# Altium schematic sheet toplayerUCM.SchDoc
size A4; SheetNumber: 1; SheetTotal: 4
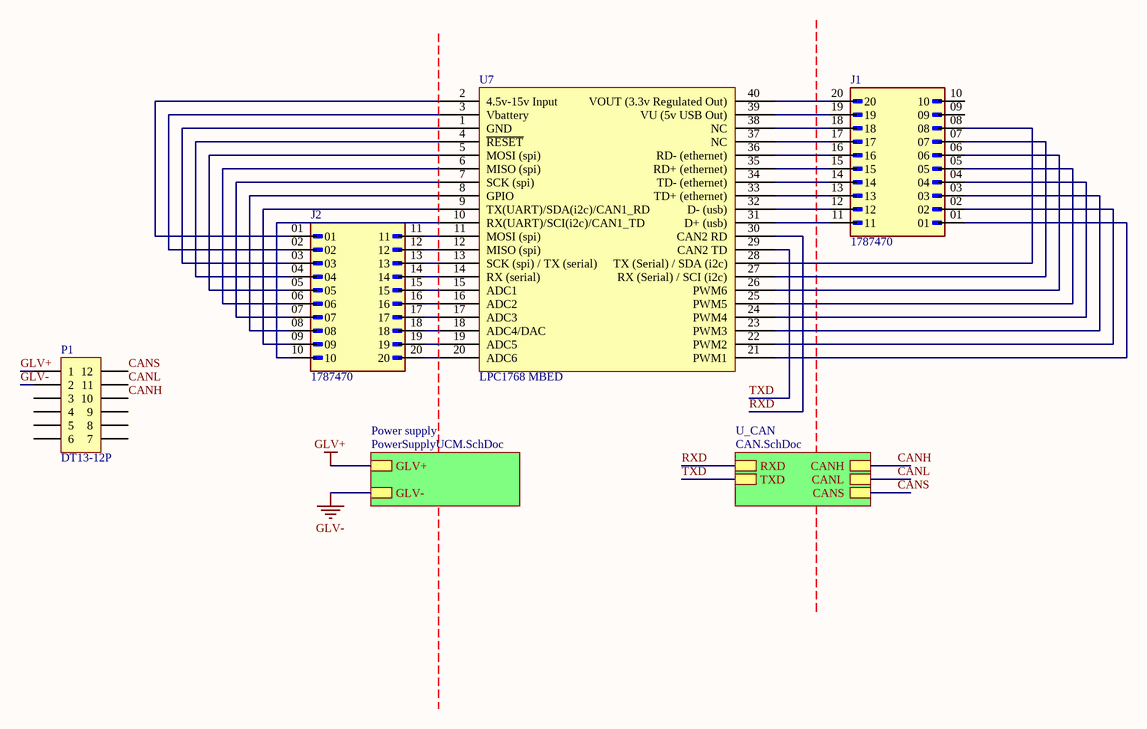
[diagram p0: toplayerUCM.SchDoc]

## Parts
J1  1787470  [PHOENIX_1787470]
J2  1787470  [PHOENIX_1787470]
P1  DT13-12P  [DT13-12P]
U7  LPC1768 MBED  [LPC1768 MBED]

## Sub-sheets
Power supply = PowerSupplyUCM.SchDoc: GLV+, GLV-
U_CAN = CAN.SchDoc: RXD, TXD, CANH, CANL, CANS

## Nets
GLV+: P1.1 ; sheet Power supply/GLV+
GLV-: P1.2 ; sheet Power supply/GLV-
CANH: P1.10 ; sheet U_CAN/CANH
CANL: P1.11 ; sheet U_CAN/CANL
CANS: P1.12 ; sheet U_CAN/CANS
RXD: U7.30(CAN2_RD) ; sheet U_CAN/RXD
TXD: U7.29(CAN2_TD) ; sheet U_CAN/TXD
NetJ1_01: J1.01 U7.21(PWM1)
NetJ1_02: J1.02 U7.22(PWM2)
NetJ1_03: J1.03 U7.23(PWM3)
NetJ1_04: J1.04 U7.24(PWM4)
NetJ1_05: J1.05 U7.25(PWM5)
NetJ1_06: J1.06 U7.26(PWM6)
NetJ1_07: J1.07 U7.27(RX_(Serial)_/_SCI_(i2c))
NetJ1_08: J1.08 U7.28(TX_(Serial)_/_SDA_(i2c))
NetJ1_11: J1.11 U7.31(D+_(usb))
NetJ1_12: J1.12 U7.32(D-_(usb))
NetJ1_13: J1.13 U7.33(TD+_(ethernet))
NetJ1_14: J1.14 U7.34(TD-_(ethernet))
NetJ1_15: J1.15 U7.35(RD+_(ethernet))
NetJ1_16: J1.16 U7.36(RD-_(ethernet))
NetJ1_17: J1.17 U7.37(NC)
NetJ1_18: J1.18 U7.38(NC)
NetJ1_19: J1.19 U7.39(VU_(5v_USB_Out))
NetJ1_20: J1.20 U7.40(VOUT_(3.3v_Regulated_Out))
NetJ2_01: J2.01 U7.2(4.5v-15v_Input)
NetJ2_02: J2.02 U7.3(Vbattery)
NetJ2_03: J2.03 U7.1(GND)
NetJ2_04: J2.04 U7.4(~{RESET})
NetJ2_05: J2.05 U7.5(MOSI_(spi))
NetJ2_06: J2.06 U7.6(MISO_(spi))
NetJ2_07: J2.07 U7.7(SCK_(spi))
NetJ2_08: J2.08 U7.8(GPIO)
NetJ2_09: J2.09 U7.9(TX(UART)/SDA(i2c)/CAN1_RD)
NetJ2_10: J2.10 U7.10(RX(UART)/SCI(i2c)/CAN1_TD)
NetJ2_11: J2.11 U7.11(MOSI_(spi))
NetJ2_12: J2.12 U7.12(MISO_(spi))
NetJ2_13: J2.13 U7.13(SCK_(spi)_/_TX_(serial))
NetJ2_14: J2.14 U7.14(RX_(serial))
NetJ2_15: J2.15 U7.15(ADC1)
NetJ2_16: J2.16 U7.16(ADC2)
NetJ2_17: J2.17 U7.17(ADC3)
NetJ2_18: J2.18 U7.18(ADC4/DAC)
NetJ2_19: J2.19 U7.19(ADC5)
NetJ2_20: J2.20 U7.20(ADC6)

Not connected (* = marked no-connect by the designer): J1 09 10; P1 3 4 5 6 7 8 9

## Library data of the parts
P1 = DT13-12P[[/\]]DT13-12P: Positions: 12; Pitch: 4.44mm; Row Spacing: 6.35mm; Angle: 90; Flange: Yes; Contact: Nickel; Part Number: DT13-12P; Digikey Part Number: 1734-1451-ND; Digikey Link: https://www.digikey.com.au/product-detail/en/te-connectivity-deutsch-connectors/DT13-12PA/1734-1451-ND/7220123
U7 = LPC1768 MBED: ARM M3 mBed Enabled Microcontroller; Manufacturer: NXP; Part Number: LPC1768 MBED; Digikey Part Number: 568-4916-ND; Digikey Link: https://www.digikey.com/product-detail/en/nxp-usa-inc/OM11043,598/568-4916-ND/2138502
J1 J2 = 1787470: Package: None; Price: None; Value: *; MP: 1787470; Availability: Unavailable